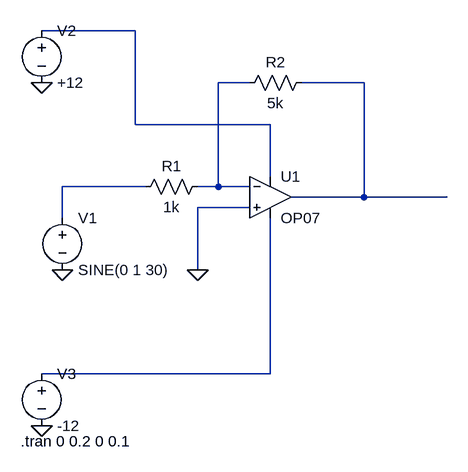
[diagram p0: schematic inverting.asc]
inverting.asc, the LTspice schematic file:
Version 4.1
SHEET 1 880 680
WIRE 16 -96 -128 -96
WIRE 192 -16 144 -16
WIRE 368 -16 272 -16
WIRE 16 48 16 -96
WIRE 224 48 16 48
WIRE 224 128 224 48
WIRE 32 144 -96 144
WIRE 144 144 144 -16
WIRE 144 144 112 144
WIRE 192 144 144 144
WIRE 368 160 368 -16
WIRE 368 160 256 160
WIRE 496 160 368 160
WIRE 192 176 112 176
WIRE -96 192 -96 144
WIRE 112 272 112 176
WIRE 224 432 224 192
WIRE 224 432 -128 432
FLAG 112 272 0
FLAG -96 272 0
FLAG -128 -16 0
FLAG -128 512 0
SYMBOL OpAmps\\OP07 224 96 R0
SYMATTR InstName U1
SYMBOL voltage -96 176 R0
WINDOW 123 0 0 Left 0
WINDOW 39 0 0 Left 0
SYMATTR InstName V1
SYMATTR Value SINE(0 1 30)
SYMBOL res 128 128 R90
WINDOW 0 0 56 VBottom 2
WINDOW 3 32 56 VTop 2
SYMATTR InstName R1
SYMATTR Value 1k
SYMBOL res 288 -32 R90
WINDOW 0 0 56 VBottom 2
WINDOW 3 32 56 VTop 2
SYMATTR InstName R2
SYMATTR Value 5k
SYMBOL voltage -128 -112 R0
WINDOW 123 0 0 Left 0
WINDOW 39 0 0 Left 0
SYMATTR InstName V2
SYMATTR Value +12
SYMBOL voltage -128 416 R0
WINDOW 123 0 0 Left 0
WINDOW 39 0 0 Left 0
SYMATTR InstName V3
SYMATTR Value -12
TEXT -160 536 Left 2 !.tran 0 0.2 0 0.1

The netlist it stands for:
* inverting.asc
X§U1 0 N002 N001 N005 N003 LT1001  ; OP07, pins In+ In- V+ V- OUT
V1 N004 0 SINE(0 1 30)
R1 N002 N004 1k
R2 N003 N002 5k
V2 N001 0 +12
V3 N005 0 -12
.tran 0 0.2 0 0.1
.lib LTC.lib
.backanno
.end